# Altium schematic sheet [07] - UNUSED.SchDoc
size A3
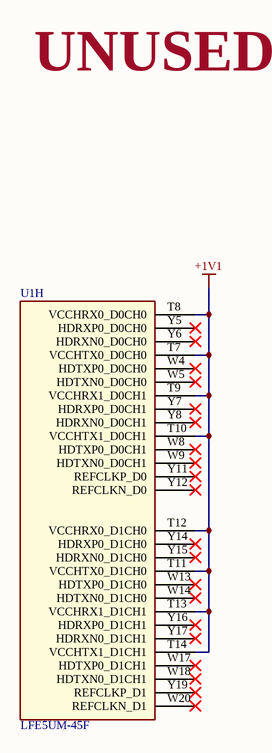
[diagram p0: [07] - UNUSED.SchDoc]

## Parts
U1  LFE5UM-45F  [LFE5BG381]  (part H of 11)

## Nets
+1V1: U1.T7(VCCHTX0_D0CH0) U1.T8(VCCHRX0_D0CH0) U1.T9(VCCHRX1_D0CH1) U1.T10(VCCHTX1_D0CH1) U1.T11(VCCHTX0_D1CH0) U1.T12(VCCHRX0_D1CH0) U1.T13(VCCHRX1_D1CH1) U1.T14(VCCHTX1_D1CH1)

Not connected (* = marked no-connect by the designer): U1 W4(HDTXP0_D0CH0)* W5(HDTXN0_D0CH0)* W8(HDTXP0_D0CH1)* W9(HDTXN0_D0CH1)* W13(HDTXP0_D1CH0)* W14(HDTXN0_D1CH0)* W17(HDTXP0_D1CH1)* W18(HDTXN0_D1CH1)* W20(REFCLKN_D1)* Y5(HDRXP0_D0CH0)* Y6(HDRXN0_D0CH0)* Y7(HDRXP0_D0CH1)* Y8(HDRXN0_D0CH1)* Y11(REFCLKP_D0)* Y12(REFCLKN_D0)* Y14(HDRXP0_D1CH0)* Y15(HDRXN0_D1CH0)* Y16(HDRXP0_D1CH1)* Y17(HDRXN0_D1CH1)* Y19(REFCLKP_D1)*

## Notes on the sheet
- UNUSED

## Library data of the parts
U1 = LFE5UM-45F-6BG381C: ECP5 Series 44 K LUTs 203 I/O 1.1 V Slow Surface Mount FPGA - CABGA-381; Manufacturer: Lattice Semiconductor; Number of Logic Blocks (LABs): 11000; Number of Logic Elements/Cells: 44000; RAM Size: 1990656b; Number of I/Os: 203; Supplier 1: Digi-Key; Manufacturer Part Number: LFE5UM-45F-6BG381C; Stock 1: 0; Pricing 1: 90=19.13967 (USD); Mount: Surface Mount; Case/Package: FBGA; Min Operating Temperature: 0°C; Max Operating Temperature: 85°C; Lead Free: Lead Free; ComponentLink1URL: http://www.latticesemi.com/~/media/LatticeSemi/Documents/DataSheets/ECP5/DS1044.pdf?src-supplier=Digi-Key; ComponentLink1Description: http://www.latticesemi.com/~/media/LatticeSemi/Documents/DataSheets/ECP5/DS1044.pdf?src-supplier=Digi-Key; Supplier Part Number 1: 220-1994-ND